# Altium project mutiADC_STM.PrjPcb
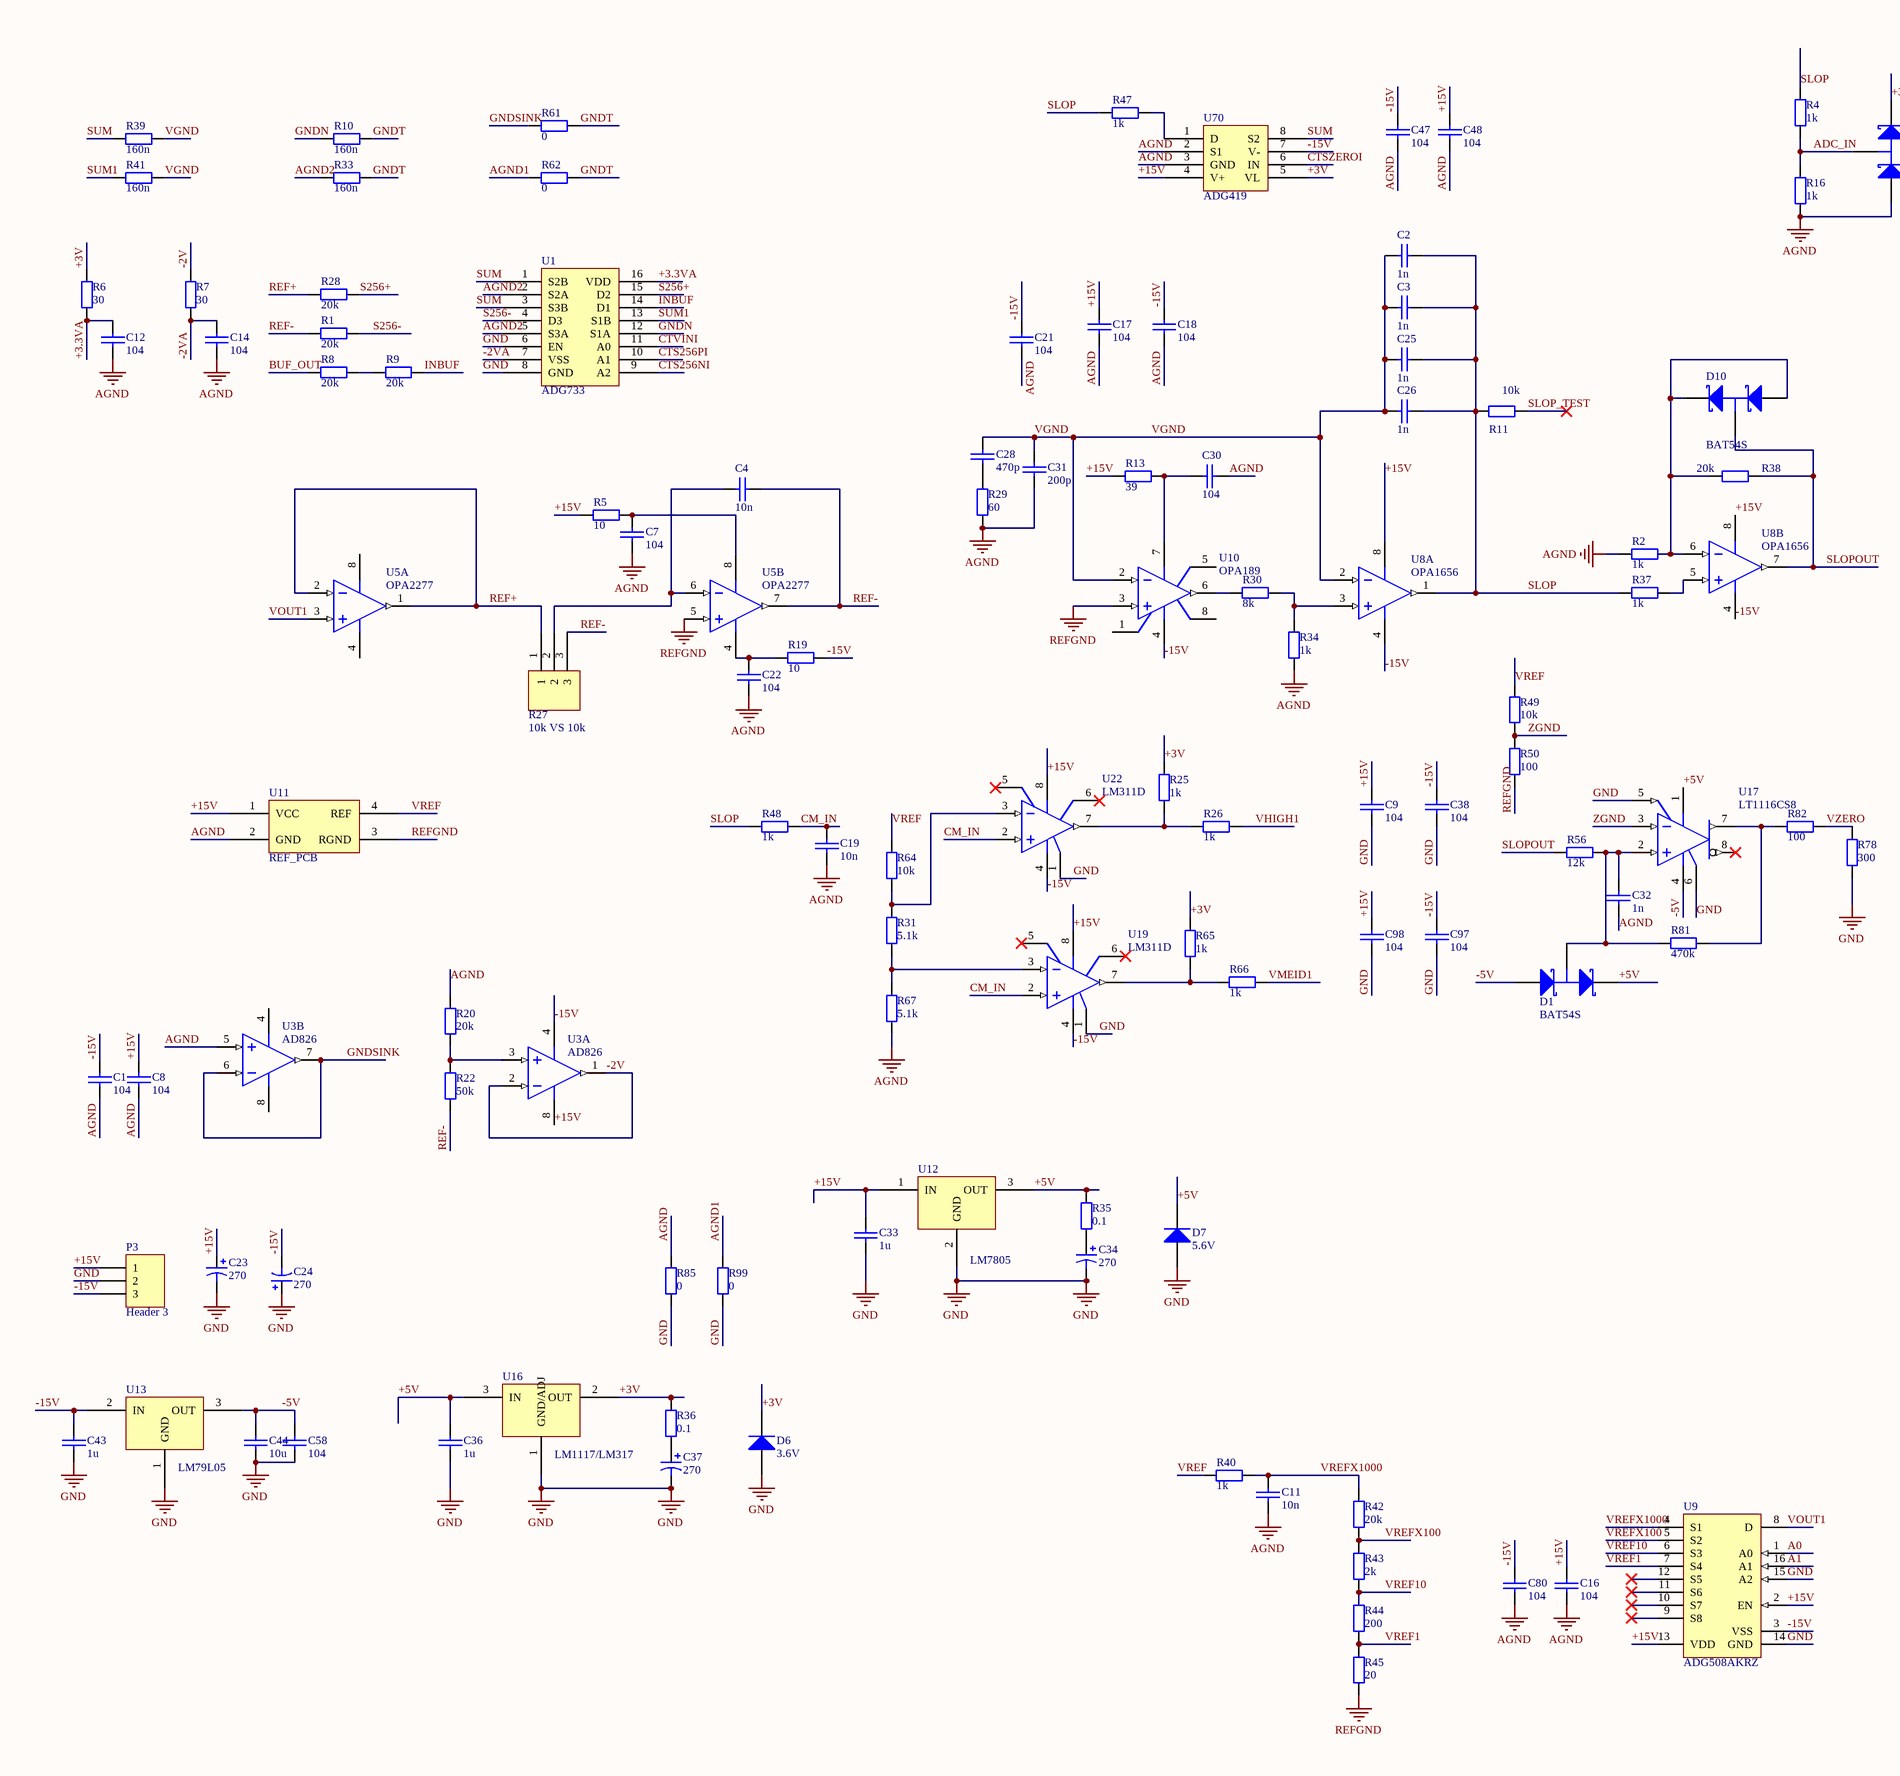
[diagram p0: mutiADC_STM.SchDoc, left]
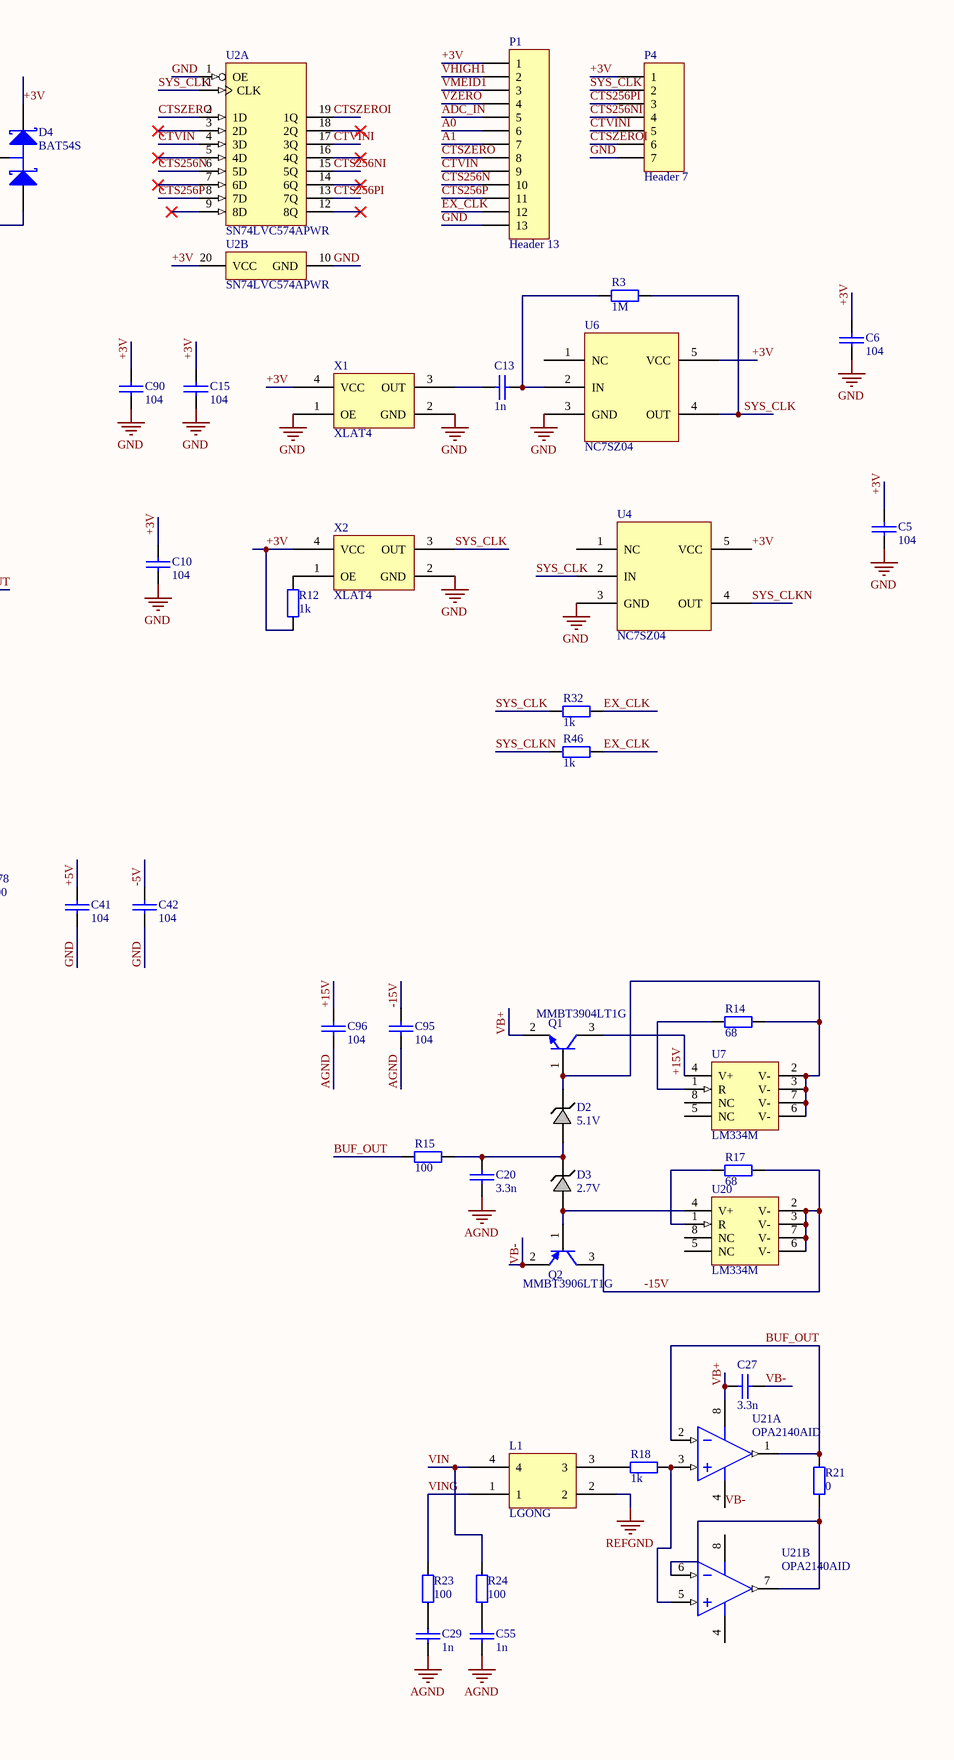
[diagram p1: mutiADC_STM.SchDoc, right]
1 sheet, 148 parts. Net scope: global (net labels, ports and power ports of the same name join across sheets).
Board file: mutiADC_STM.PcbDoc

## Sheet mutiADC_STM.SchDoc
size A2

### Parts
C1  104  [LC-0603_C]
C2  1n  [res_381_L]
C3  1n  [LC-1206_C]
C4  10n  [LC-0805_C]
C5  104  [LC-0603_C]
C6  104  [LC-0603_C]
C7  104  [LC-0603_C]
C8  104  [LC-0603_C]
C9  104  [LC-0603_C]
C10  104  [LC-0603_C]
C11  10n  [LC-0805_C]
C12  104  [LC-0603_C]
C13  1n  [LC-0603_C]
C14  104  [LC-0603_C]
C15  104  [LC-0603_C]
C16  104  [LC-0603_C]
C17  104  [LC-0603_C]
C18  104  [LC-0603_C]
C19  10n  [LC-0603_C]
C20  3.3n  [LC-0603_C]
C21  104  [LC-0603_C]
C22  104  [LC-0603_C]
C23  270  [CAP2.5_65]
C24  270  [CAP2.5_65]
C25  1n  [LC-0805_C]
C26  1n  [LC-0805_C]
C27  3.3n  [LC-0603_C]
C28  470p  [LC-0805_C]
C29  1n  [LC-0603_C]
C30  104  [LC-0603_C]
C31  200p  [LC-0603_C]
C32  1n  [LC-0603_C]
C33  1u  [LC-0805_C]
C34  270  [CAP2.5_65]
C36  1u  [LC-0805_C]
C37  270  [CAP2.5_65]
C38  104  [LC-0603_C]
C41  104  [LC-0603_C]
C42  104  [LC-0603_C]
C43  1u  [LC-1210_C]
C44  10u  [LC-1210_C]
C47  104  [LC-0603_C]
C48  104  [LC-0603_C]
C55  1n  [LC-0603_C]
C58  104  [LC-0603_C]
C80  104  [LC-0603_C]
C90  104  [LC-0603_C]
C95  104  [LC-0603_C]
C96  104  [LC-0603_C]
C97  104  [LC-0603_C]
C98  104  [LC-0603_C]
D1  BAT54S  [LC-SOT-23(SOT-23-3)]
D2  5.1V  [SOD-123]
D3  2.7V  [SOD-123]
D4  BAT54S  [LC-SOT-23(SOT-23-3)]
D6  3.6V  [LC-DO-213AA]
D7  5.6V  [LC-DO-213AA]
D10  BAT54S  [LC-SOT-23(SOT-23-3)]
L1  LGONG  [LM4]
P1  Header 13  [HDR1X13]
P3  Header 3  [HDR1X3]
P4  Header 7  [HDR1X7]
Q1  MMBT3904LT1G  [ONSC-SOT-23-3-318-08_V]
Q2  MMBT3906LT1G  [ONSC-SOT-23-3-318-08_V]
R1  20k  [res_381]
R2  1k  [LC-0603_R]
R3  1M  [LC-0603_R]
R4  1k  [LC-0603_R]
R5  10  [LC-0603_R]
R6  30  [LC-0603_R]
R7  30  [LC-0603_R]
R8  20k  [res_381]
R9  20k  [res_381]
R10  160n  [LC-0805_R]
R11  10k  [LC-0603_R]
R12  1k  [LC-0603_R]
R13  39  [LC-0603_R]
R14  68  [LC-0603_R]
R15  100  [LC-0603_R]
R16  1k  [LC-0603_R]
R17  68  [LC-0603_R]
R18  1k  [LC-0603_R]
R19  10  [LC-0603_R]
R20  20k  [LC-0603_R]
R21  0  [LC-0603_R]
R22  50k  [LC-0603_R]
R23  100  [LC-0603_R]
R24  100  [LC-0603_R]
R25  1k  [LC-0603_R]
R26  1k  [LC-0603_R]
R27  10k VS 10k  [HDR1x3]
R28  20k  [res_381]
R29  60  [LC-0805_R]
R30  8k  [LC-0603_R]
R31  5.1k  [LC-0603_R]
R32  1k  [LC-0603_R]
R33  160n  [LC-0805_R]
R34  1k  [LC-0603_R]
R35  0.1  [LC-1206_R]
R36  0.1  [LC-1206_R]
R37  1k  [LC-0603_R]
R38  20k  [LC-0603_R]
R39  160n  [LC-0805_R]
R40  1k  [LC-0603_R]
R41  160n  [LC-0805_R]
R42  20k  [res_381]
R43  2k  [res_381]
R44  200  [LC-0603_R]
R45  20  [LC-0603_R]
R46  1k  [LC-0603_R]
R47  1k  [LC-0603_R]
R48  1k  [LC-0603_R]
R49  10k  [LC-0603_R]
R50  100  [LC-0603_R]
R56  12k  [LC-0603_R]
R61  0  [LC-1206_R]
R62  0  [LC-1206_R]
R64  10k  [LC-0603_R]
R65  1k  [LC-0603_R]
R66  1k  [LC-0603_R]
R67  5.1k  [LC-0603_R]
R78  300  [LC-0603_R]
R81  470k  [LC-0603_R]
R82  100  [LC-0603_R]
R85  0  [LC-1206_R]
R99  0  [LC-1206_R]
U1  ADG733  [LC-TSSOP-16]
U2  SN74LVC574APWR  [PW0020A_L]  (parts A,B of 2)
U3  AD826  [LC-SOP-8_150mil]  (parts A,B of 2)
U4  NC7SZ04  [LC-SC-70-5]
U5  OPA2277  [D0008A_N]  (parts A,B of 2)
U6  NC7SZ04  [LC-SC-70-5]
U7  LM334M  [D0008A_L]
U8  OPA1656  [D0008A_N]  (parts A,B of 2)
U9  ADG508AKRZ  [ADI-R-16_N]
U10  OPA189  [LC-SOIC-8_150mil]
U11  REF_PCB  [REF_PCB]
U12  LM7805  [LC-TO-252-2]
U13  LM79L05  [LC-SOT-89(SOT-89-3)]
U16  LM1117/LM317  [LC-TO-252-2]
U17  LT1116CS8  [NSO8_N]
U19  LM311D  [LC-SOIC-8_150mil]
U20  LM334M  [D0008A_L]
U21  OPA2140AID  [D0008A_N]  (parts A,B of 2)
U22  LM311D  [LC-SOIC-8_150mil]
U70  ADG419  [LC-SOIC-8_150mil]
X1  XLAT4  [SMD_2520]
X2  XLAT4  [SMD_2520]

### Nets
AGND: C1.2 C7.1 C8.2 C11.1 C12.2 C14.2 C16.1 C17.2 C18.2 C19.1 C20.1 C21.2 C22.1 C29.2 C30.2 C31.2 C32.2 C47.2 C48.2 C55.2 C80.1 C95.2 C96.2 D4.1(A) R2.1 R16.1 R20.1 R29.1 R34.2 R67.2 R85.1 U3.5(IN+) U11.2(GND) U70.2(S1) U70.3(GND)
GND: C5.2 C6.2 C9.2 C10.2 C15.2 C23.2 C24.1 C33.2 C34.2 C36.2 C37.2 C38.2 C41.2 C42.2 C43.2 C44.2 C58.2 C90.2 C97.2 C98.2 D6.1(A) D7.1(A) P1.13 P3.2 P4.7 R78.1 R85.2 R99.2 U1.6(EN) U1.8(GND) U2.1(OE) U2.10(GND) U4.3(GND) U6.3(GND) U9.14(GND) U9.15(A2) U12.2(GND) U13.1(GND) U16.1(GND/ADJ) U17.5(LE) U17.6(GND) U19.1(GND) U22.1(GND) X1.1(OE) X1.2(GND) X2.2(GND)
REFGND: L1.2 R45.2 R50.1 U5.5(IN_B+) U10.3(IN+) U11.3(RGND)
+3.3VA: C12.1 R6.2 U1.16(VDD)
+3V: C5.1 C6.1 C10.1 C15.1 C90.1 D4.2(K) D6.2(K) P1.1 P4.1 R6.1 R12.1 R25.1 R36.1 R65.1 U2.20(VCC) U4.5(VCC) U6.5(VCC) U16.2(OUT) U70.5(VL) X1.4(VCC) X2.4(VCC)
+5V: C36.1 C41.1 D1.2(K) D7.2(K) R35.1 U12.3(OUT) U16.3(IN) U17.1(V+)
+15V: C8.1 C9.1 C16.2 C17.1 C23.1 C33.1 C48.1 C96.1 C98.1 P3.1 Q1.3(C) R5.1 R13.2 U3.8(V+) U7.4(V+) U8.8(V+) U9.2(EN) U9.13(VDD) U11.1(VCC) U12.1(IN) U19.8(V+) U22.8(V+) U70.4(V+)
-2V: R7.1 U3.1(OUT) U3.2(IN-)
-2VA: C14.1 R7.2 U1.7(VSS)
-5V: C42.1 C44.1 C58.1 D1.1(A) U13.3(OUT) U17.4(V-)
-15V: C1.1 C18.1 C21.1 C24.2 C38.1 C43.1 C47.1 C80.2 C95.1 C97.1 P3.3 Q2.3(C) R17.2 R19.2 U3.4(V-) U8.4(V-) U9.3(VSS) U10.4(V-) U13.2(IN) U19.4(V-) U20.2(V-) U20.3(V-) U20.6(V-) U20.7(V-) U22.4(V-) U70.7(V-)
A0: P1.6 U9.1(A0)
A1: P1.7 U9.16(A1)
ADC_IN: D4.3(C) P1.5 R4.1 R16.2
AGND1: R62.2 R99.1
AGND2: R33.2 U1.2(S2A) U1.5(S3A)
BUF_OUT: R8.2 R15.1 R21.2 U21.1(OUT_A) U21.2(IN_A-)
CM_IN: C19.2 R48.2 U19.2(IN+) U22.2(IN+)
CTS256N: P1.10 U2.6(5D)
CTS256NI: P4.4 U1.9(A2) U2.15(5Q)
CTS256P: P1.11 U2.8(7D)
CTS256PI: P4.3 U1.10(A1) U2.13(7Q)
CTSZERO: P1.8 U2.2(1D)
CTSZEROI: P4.6 U2.19(1Q) U70.6(IN)
CTVIN: P1.9 U2.4(3D)
CTVINI: P4.5 U1.11(A0) U2.17(3Q)
EX_CLK: P1.12 R32.2 R46.2
GNDN: R10.2 U1.12(S1A)
GNDSINK: R61.2 U3.6(IN-) U3.7(OUT)
GNDT: R10.1 R33.1 R61.1 R62.1
INBUF: R9.1 U1.14(D1)
REF+: R27.1 R28.2 U5.1(OUT_A) U5.2(IN_A-)
REF-: C4.2 R1.2 R22.2 R27.3 U5.7(OUT_B)
S256+: R28.1 U1.15(D2)
S256-: R1.1 U1.4(D3)
SLOP: C2.1 C3.1 C25.1 C26.1 R4.2 R11.2 R37.1 R47.1 R48.1 U8.1(OUT_A)
SLOP_TEST: R11.1
SLOPOUT: D10.3(C) R38.1 R56.1 U8.7(OUT_B)
SUM: R39.2 U1.1(S2B) U1.3(S3B) U70.8(S2)
SUM1: R41.2 U1.13(S1B)
SYS_CLK: P4.2 R3.1 R32.1 U2.11(CLK) U4.2(IN) U6.4(OUT) X2.3(OUT)
SYS_CLKN: R46.1 U4.4(OUT)
VB+: C27.2 Q1.2(E) U21.8(V+)
VB-: C27.1 Q2.2(E) U21.4(V-)
VGND: C2.2 C3.2 C25.2 C26.2 C28.1 C31.1 R39.1 R41.1 U8.2(IN_A-) U10.2(IN-)
VHIGH1: P1.2 R26.2
VIN: L1.4 R24.2
VING: L1.1 R23.2
VMEID1: P1.3 R66.2
VOUT1: U5.3(IN_A+) U9.8(D)
VREF: R40.1 R49.2 R64.1 U11.4(REF)
VREF1: R44.2 R45.1 U9.7(S4)
VREF10: R43.2 R44.1 U9.6(S3)
VREFX100: R42.2 R43.1 U9.5(S2)
VREFX1000: C11.2 R40.2 R42.1 U9.4(S1)
VZERO: P1.4 R78.2 R82.2
ZGND: R49.1 R50.2 U17.3(IN-)
NetC4_1: C4.1 R27.2 U5.6(IN_B-)
NetC7_2: C7.2 R5.2 U5.8(V+)
NetC13_1: C13.1 X1.3(OUT)
NetC13_2: C13.2 R3.2 U6.2(IN)
NetC20_2: C20.2 D2.1(A) D3.2(K) R15.2
NetC22_2: C22.2 R19.1 U5.4(V-)
NetC28_2: C28.2 R29.2
NetC29_1: C29.1 R23.1
NetC30_1: C30.1 R13.1 U10.7(V+)
NetC32_1: C32.1 D1.3(C) R56.2 R81.1 U17.2(IN+)
NetC34_1: C34.1 R35.2
NetC37_1: C37.1 R36.2
NetC55_1: C55.1 R24.1
NetD2_2: D2.2(K) Q1.1(B) R14.2 U7.2(V-) U7.3(V-) U7.6(V-) U7.7(V-)
NetD3_1: D3.1(A) Q2.1(B) U20.4(V+)
NetD10_1: D10.1(A) D10.2(K) R2.2 R38.2 U8.6(IN_B-)
NetL1_3: L1.3 R18.1
NetR8_1: R8.1 R9.2
NetR12_2: R12.2 X2.1(OE)
NetR14_1: R14.1 U7.1(R)
NetR17_1: R17.1 U20.1(R)
NetR18_2: R18.2 U21.3(IN_A+) U21.5(IN_B+)
NetR20_2: R20.2 R22.1 U3.3(IN+)
NetR21_1: R21.1 U21.6(IN_B-) U21.7(OUT_B)
NetR25_2: R25.2 R26.1 U22.7(OUT)
NetR30_1: R30.1 R34.1 U8.3(IN_A+)
NetR30_2: R30.2 U10.6(OUT)
NetR31_1: R31.1 R64.2 U22.3(IN-)
NetR31_2: R31.2 R67.1 U19.3(IN-)
NetR37_2: R37.2 U8.5(IN_B+)
NetR47_2: R47.2 U70.1(D)
NetR65_2: R65.2 R66.1 U19.7(OUT)
NetR81_2: R81.2 R82.1 U17.7(Q)

Not connected (* = marked no-connect by the designer): U2 3(2D)* 5(4D)* 7(6D)* 9(8D)* 12(8Q)* 14(6Q)* 16(4Q)* 18(2Q)*; U4 1(NC); U6 1(NC); U7 5(NC) 8(NC); U9 9(S8)* 10(S7)* 11(S6)* 12(S5)*; U10 1(CMPEN) 5(NC) 8(CMPEN); U17 8(~{Q})*; U19 5(BAL)* 6(BAL/STB)*; U20 5(NC) 8(NC); U22 5(BAL)* 6(BAL/STB)*

### Library data of the parts
C1-C34 C36-C38 C41-C44 C47 C48 C55 C58 C80 C90 C95-C98 = CAP
D1 D4 D10 = BAT54S: Schottky Barrier Double Diode; Published: 17-Sep-2003; LatestRevisionDate: 12-Dec-2006; LatestRevisionNote: IPC-7351 Footprint Added.; DatasheetVersion: 4-Mar-2002; PackageVersion: May-1999; PackageReference: SOT23; Publisher: Altium Limited; PackageDescription: 3-Pin SOT-23 Package 0.95 mm Pitch, 2.3 mm Lead Span; ComponentLink1Description: Manufacturer Link; ComponentLink1URL: http://www.semiconductors.philips.com/; ComponentLink2Description: Datasheet; ComponentLink2URL: http://www.semiconductors.philips.com/acrobat/datasheets/BAT54_SERIES_4.pdf
D2 D3 = BZT52C16_[C2105]: Imported; BOM_Manufacturer: CJ; LCEDA2ULVersion: 0.1.6865.39546; ComponentLink1Description: 供应商链接; ComponentLink1URL: https://so.szlcsc.com/global.html?c=&k=C2105; Supplier: LCSC; SuppliersPartNumber: C2105; BOM_Manufacturer_Part: BZT52C16; EditorVersion: 3.12.3; uuid: ca04ec34450a02ae72afae8c1a59e195; utime: 2017/1/4 21:18:35; LCEDA_url: https://lceda.cn/editor#id=!ca04ec34450a02ae72afae8c1a59e195; Publisher: JLC_SMT
D6 D7 = Diode 1N4006: 1 Amp General Purpose Rectifier; Published: 8-Jun-2000; LatestRevisionDate: 17-Jul-2002; LatestRevisionNote: Re-released for DXP Platform.; DatasheetVersion: 1998; PackageVersion: Aug-1999; PackageReference: DO-41; Publisher: Altium Limited; PackageDescription: Diode, Axial; Body 5.2 x 2.7 mm (LxDia. max), Lead Dia. 0.86 mm (max); Code_JEDEC: DO-204-AL; ComponentLink1Description: Manufacturer Link; ComponentLink1URL: http://www.fairchildsemi.com/; ComponentLink2Description: Datasheet; ComponentLink2URL: http://www.fairchildsemi.com/ds/1N%2F1N4001.pdf
P1 = Header 13: Header, 13-Pin; LatestRevisionDate: 17-Jul-2002; LatestRevisionNote: Re-released for DXP Platform.; Publisher: Altium Limited
P3 = Header 3: Header, 3-Pin; LatestRevisionDate: 17-Jul-2002; LatestRevisionNote: Re-released for DXP Platform.; Publisher: Altium Limited
P4 = Header 7: Header, 7-Pin; LatestRevisionDate: 17-Jul-2002; LatestRevisionNote: Re-released for DXP Platform.; Publisher: Altium Limited
Q1 = CMP-1048-00631-1: General Purpose Transistor, NPN Silicon, 3-Pin SOT-23, Pb-Free, Tape and Reel; Manufacturer: On Semiconductor; IC Continuous (A): 0.2; fT Min (MHz): 300; ComponentLink2Description: Datasheet; Polarity: NPN; PackageDescription: 3-Pin Small Outline Transistor, Body 2.92 x 1.3 mm, Pitch 0.95 mm; ComponentLink2URL: http://www.onsemi.cn/pub_link/Collateral/MMBT3904LT1-D.PDF; DatasheetVersion: Rev. 12; Mounting Technology: Surface Mount; PartNumber: MMBT3904LT1G; ComponentLink1URL: http://www.onsemi.com/; ComponentLink3Description: Package Specification; ComponentLink1Description: Manufacturer URL; PackageVersion: Rev. AP, 11/2009; PackageReference: SOT-23-3-318-08; Packing: Tape and Reel; ComponentLink3URL: http://www.onsemi.cn/pub_link/Collateral/318-08.PDF; RoHS: TRUE
Q2 = CMP-1048-00670-1: General Purpose Transistor, PNP Silicon, 3-Pin SOT-23, Pb-Free, Tape and Reel; Manufacturer: On Semiconductor; IC Continuous (A): -0.2; fT Min (MHz): 250; PackageDescription: 3-Pin Small Outline Transistor, Body 2.92 x 1.3 mm, Pitch 0.95 mm; PartNumber: MMBT3906LT1G; Packing: Tape and Reel; ComponentLink3Description: Package Specification; Mounting Technology: Surface Mount; ComponentLink3URL: http://www.onsemi.cn/pub_link/Collateral/318-08.PDF; ComponentLink1URL: http://www.onsemi.com/; ComponentLink2URL: http://www.onsemi.cn/pub_link/Collateral/MMBT3906LT1-D.PDF; PackageReference: SOT-23-3-318-08; Polarity: PNP; ComponentLink2Description: Datasheet; PackageVersion: Rev. AP, 11/2009; RoHS: TRUE; DatasheetVersion: Rev. 11; ComponentLink1Description: Manufacturer URL
R1 R3 R5-R11 R13-R15 R17 R19-R24 R28-R31 R33 R35 R36 R38 R39 R41-R45 R49 R50 R56 R61 R62 R64 R67 R78 R81 R82 R85 R99 = Res2: Resistor; Value: 1K; Published: 8-Jun-2000; LatestRevisionDate: 17-Jul-2002; LatestRevisionNote: Re-released for DXP Platform.; PackageReference: AXIAL-0.4; Publisher: Altium Limited; PackageDescription: Axial Device, Thru-Hole; 2 Leads; 0.4 in Pin Spacing
R2 R4 R12 R16 R18 R25 R26 R32 R34 R37 R40 R46-R48 R65 R66 = Res2: Resistor; Published: 8-Jun-2000; LatestRevisionDate: 17-Jul-2002; LatestRevisionNote: Re-released for DXP Platform.; PackageReference: AXIAL-0.4; Publisher: Altium Limited; PackageDescription: Axial Device, Thru-Hole; 2 Leads; 0.4 in Pin Spacing; Value: 1K
R27 = LS_RES
U2 = CMP-1619-01020-2: Octal Edge-Triggered D-Type Flip-Flop With 3-State Outputs, PW0020A, LARGE T&R; Manufacturer: Texas Instruments; Technology Family: LVC; Voltage(Nom)(V): 1.8,2.5,2.7,3.3; F @ Nom Voltage(Max)(Mhz): 100; VCC(Max)(V): 3.6; Input Type: TTL,CMOS; Rating: Catalog; ICC @ Nom Voltage(Max)(mA): 0.01; Output Drive (IOL/IOH)(Max)(mA): 24/-24; Output Type: CMOS; Bits(#): 8; 3-State Output: Yes; tpd @ Nom Voltage(Max)(ns): 21.5,10,7.8,8.8; Output Logic: Non-inverted; VCC(Min)(V): 1.65; Schmitt Trigger: No; Code_JEDEC: MO-153; DatasheetVersion: SCAS301R; Generic Part Number: SN74LVC574A; Operating Temperature Range(C): -40 to 125,-40 to 85,-55 to 125; PackageReference: PW0020A
U3 = TL072ACD: Low-Noise JFET-Input Operational Amplifier; Published: 17-Jul-2002; LatestRevisionDate: 13-Apr-2006; LatestRevisionNote: IPC-7351 Footprint Added.; DatasheetVersion: 1988; PackageReference: 751-02; Publisher: Altium Limited; PackageDescription: 8-Pin Small Outline Integrated Circuit 1.27 mm Pitch; Code_JEDEC: MS-012-AA; Code_IPC: SOIC127P600-8; ComponentLink1Description: Manufacturer Link; ComponentLink1URL: http://www.onsemi.com/site/products/parametrics/0,4446,251,00.html
U5 U8 = CMP-0272-00255-3: 11 MHz, Precision, Low Noise, Rail-to-Rail Output, JFET Operational Amplifier, 4.5 to 36 V, -40 to 125 degC, 8-pin SOIC (D8), Green (RoHS & no Sb/Br); Manufacturer: Texas Instruments; PartNumber: OPA2140AID; CMRR(Min)(dB): 126; Packing: TUBE; Offset Drift(Typ)(uV/C): 0.35; Total Supply Voltage(Min)(+5V is 5, +/-5V is 10): 4.5; Total Supply Voltage(Max)(+5V is 5, +/-5V is 10): 36; Rating: Catalog; Iq per channel(Max)(mA): 2; Slew Rate(Typ)(V/us): 20; Vio (25C)(Max)(mV): 0.12; GBW(Typ)(MHz): 11; Sub Family: High Supply Voltage Amplifier (>=30V), Low Input Bias Current Amp (<=10pA), Low Noise Amp (<=10nV/rtHz), Low Offset Voltage Amplifier (<=500uV), Precision Amplifier; IIB(Max)(pA): 10; ComponentLink3Description: Package Specification; DatasheetVersion: SBOS498A; ComponentLink1Description: Manufacturer URL; Eco-Plan: Green (RoHS & no Sb/Br); ComponentLink1URL: http://www.ti.com/; Code_JEDEC: MS-012; Number of Channels: 2; ComponentLink2URL: http://www.ti.com/lit/ds/symlink/opa2140.pdf; PackageDescription: 8-Pin Plastic Small Outline, Body 4.9 x 3.9 mm, Pitch 1.27 mm; Mounting Technology: Surface Mount; PackageReference: D0008A; ComponentLink2Description: Datasheet; PackageVersion: 4040047-3/M, 06/2011; ComponentLink3URL: http://www.ti.com/litv/pdf/msoi002j
U7 U20 = CMP-0063-00575-4: 3-Terminal Adjustable Current Source, 8-pin Narrow SOIC; Manufacturer: Texas Instruments; CompType: MiscPower; High-Reliability: Y; PowerWise: N; PackageTopMarking: NSZXTT*LM334*M; PartNumber: LM334M; PackageDescription: SOIC Narrow, 4.9 x 3.9 x 1.45mm, 8 Lead, 1.27mm Pitch; PackageReference: D0008A; PinCount: 8; ComponentLink1URL: http://www.ti.com/general/docs/lit/getliterature.tsp?genericPartNumber=LM334&fileType=pdf; ComponentLink1Description: Datasheet URL; Code_JEDEC: MS-012-AA; Code_IPC: SOIC127P600-8; RoHS: N
U9 = CMP-0793-00084-1: CMOS 8-Channel Analog Multiplexer, 280 Ohm / 500 Ohm Ron, 16-pin SOIC (R-16), Tube; Manufacturer: Analog Devices; t transition (s): 200n; Max Analog Signal Range: Vss to Vdd; Ron (ohms): 280; ComponentLink3Description: Package Specification; Mounting Technology: Surface Mount; PartNumber: ADG508AKRZ; ComponentLink2URL: http://www.analog.com/static/imported-files/data_sheets/ADG508A_509A.pdf; ComponentLink1URL: http://www.analog.com/en/index.html; Code_JEDEC: MS-012-AC; Packing: Tube; ComponentLink2Description: Datasheet; ComponentLink1Description: Manufacturer URL; PackageReference: R-16; DatasheetVersion: Rev. D; PackageVersion: 060606-A, 06/2006; ComponentLink3URL: http://www.analog.com/static/imported-files/packages/PKG_PDF/SOIC_Narrow%20(R)/R_16.pdf; PackageDescription: 16-Pin Standard Small Outline Package, Body 9.9 x 3.9 mm, Pitch 1.27 mm
U10 = OP27GS: Low-Noise, Precision Operational Amplifier; Note: Pin 5 is not connected.; Published: 8-Jun-2000; LatestRevisionDate: 13-Apr-2006; LatestRevisionNote: IPC-7351 Footprint Added.; DatasheetVersion: 1992; PackageVersion: revA; PackageReference: SO-8; Publisher: Altium Limited; PackageDescription: 8-Pin Small Outline Integrated Circuit 1.27 mm Pitch; Code_JEDEC: MS-012-AA; Code_IPC: SOIC127P600-8; ComponentLink1Description: Manufacturer Link; ComponentLink1URL: http://www.analog.com/en/prod/0,,759_786_OP27%2C00.html; ComponentLink2Description: Datasheet; ComponentLink2URL: http://www.analog.com/UploadedFiles/Data_Sheets/314538596OP27_c.pdf
U17 = LT1116CS8: Ultra-Fast, Precision TTL Comparator; Published: 16-Jan-2001; LatestRevisionDate: 13-Apr-2006; LatestRevisionNote: IPC-7351 Footprint Added.; DatasheetVersion: Mar-1993; PackageReference: NSO8; Publisher: Altium Limited; PackageDescription: 8-Pin Small Outline Integrated Circuit 1.27 mm Pitch; Code_JEDEC: MS-012-AA; Code_IPC: SOIC127P600-8; ComponentLink1Description: Manufacturer Link; ComponentLink1URL: http://www.maxim-ic.com/
U19 U22 = LM311D: High-Performance Voltage Comparator; Published: 17-Jul-2002; LatestRevisionDate: 13-Apr-2006; LatestRevisionNote: IPC-7351 Footprint Added.; DatasheetVersion: 1988; PackageReference: 751-02; Publisher: Altium Limited; PackageDescription: 8-Pin Small Outline Integrated Circuit 1.27 mm Pitch; Code_JEDEC: MS-012-AA; Code_IPC: SOIC127P600-8; ComponentLink1Description: Manufacturer Link; ComponentLink1URL: http://www.onsemi.com/site/products/taxonomy/0,4438,133,00.html
U21 = CMP-0272-00255-3: 11 MHz, Precision, Low Noise, Rail-to-Rail Output, JFET Operational Amplifier, 4.5 to 36 V, -40 to 125 degC, 8-pin SOIC (D8), Green (RoHS & no Sb/Br); Manufacturer: Texas Instruments; CMRR(Min)(dB): 126; Packing: TUBE; Offset Drift(Typ)(uV/C): 0.35; Total Supply Voltage(Min)(+5V is 5, +/-5V is 10): 4.5; Total Supply Voltage(Max)(+5V is 5, +/-5V is 10): 36; Rating: Catalog; Iq per channel(Max)(mA): 2; Slew Rate(Typ)(V/us): 20; Vio (25C)(Max)(mV): 0.12; GBW(Typ)(MHz): 11; Sub Family: High Supply Voltage Amplifier (>=30V), Low Input Bias Current Amp (<=10pA), Low Noise Amp (<=10nV/rtHz), Low Offset Voltage Amplifier (<=500uV), Precision Amplifier; IIB(Max)(pA): 10; ComponentLink3Description: Package Specification; DatasheetVersion: SBOS498A; ComponentLink1Description: Manufacturer URL; Eco-Plan: Green (RoHS & no Sb/Br); ComponentLink1URL: http://www.ti.com/; PartNumber: OPA2140AID; Code_JEDEC: MS-012; Number of Channels: 2; ComponentLink2URL: http://www.ti.com/lit/ds/symlink/opa2140.pdf; PackageDescription: 8-Pin Plastic Small Outline, Body 4.9 x 3.9 mm, Pitch 1.27 mm; Mounting Technology: Surface Mount; PackageReference: D0008A; ComponentLink2Description: Datasheet; PackageVersion: 4040047-3/M, 06/2011; ComponentLink3URL: http://www.ti.com/litv/pdf/msoi002j